# EAGLE design Adafruit 0.54 Alphanumeric v0.1 (EAGLE 6.3)
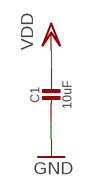
[diagram p0: schematic, sheet 1, part 1 of 2]
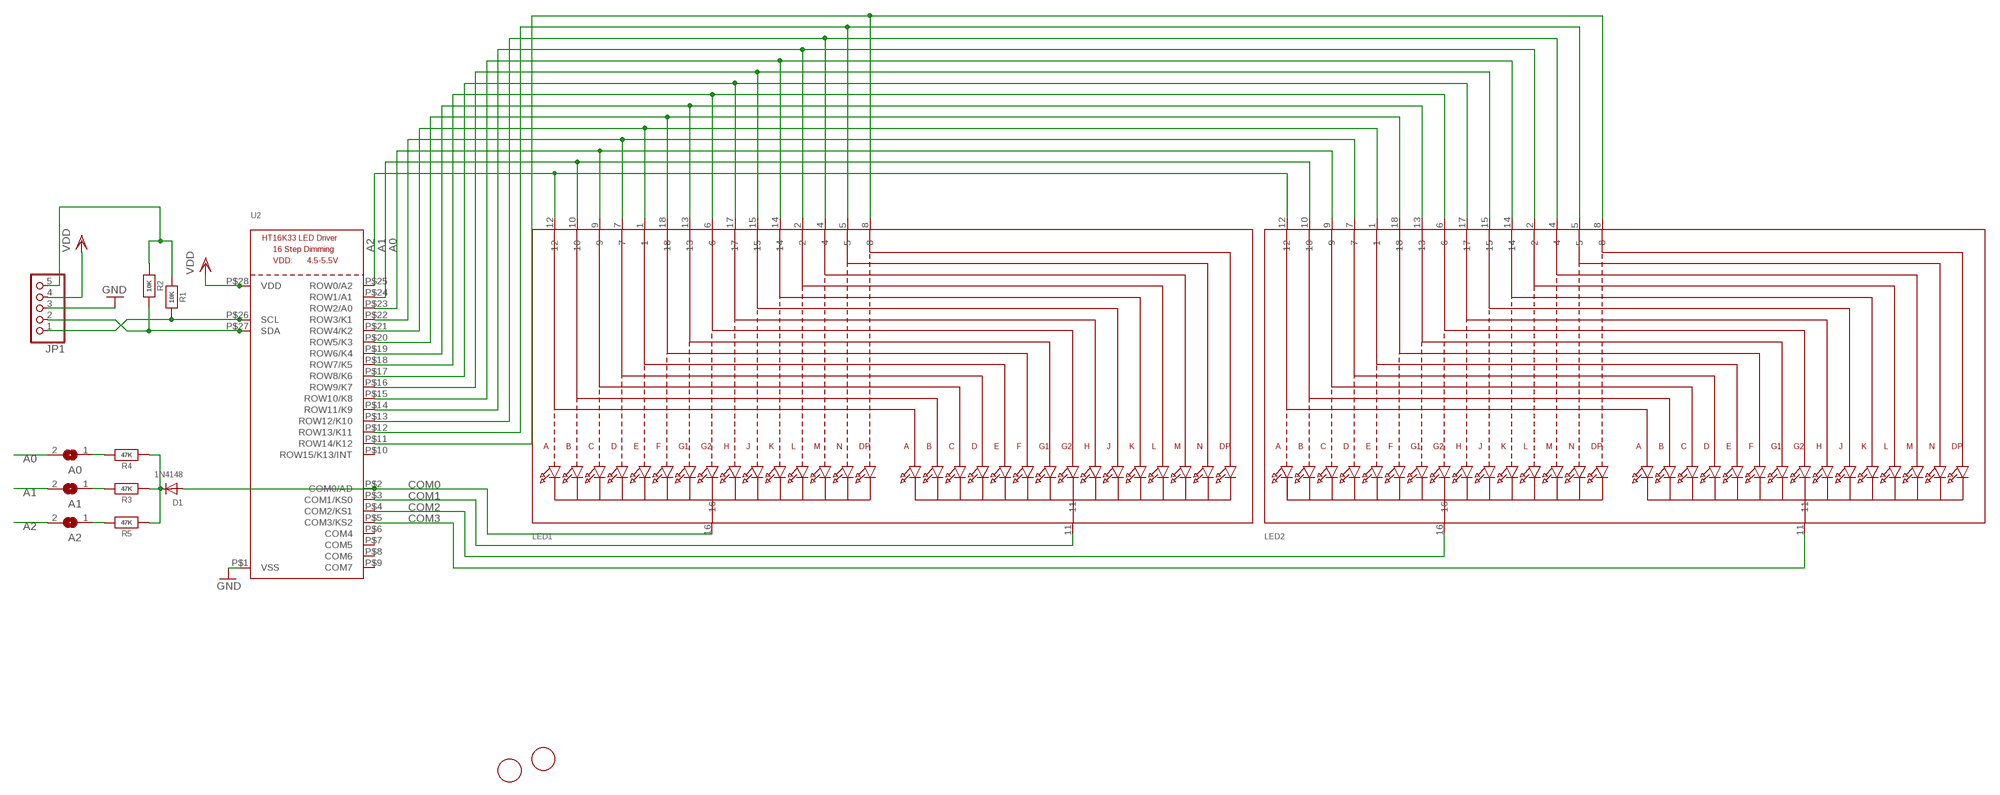
[diagram p1: schematic, sheet 1, part 2 of 2]

## Parts
A0  SOLDERJUMPERREFLOW_NOPASTE  [SOLDERJUMPER_REFLOW_NOPASTE]
A1  SOLDERJUMPERREFLOW_NOPASTE  [SOLDERJUMPER_REFLOW_NOPASTE]
A2  SOLDERJUMPERREFLOW_NOPASTE  [SOLDERJUMPER_REFLOW_NOPASTE]
C1  10uF  CAP_CERAMIC0805-NOOUTLINE  [0805-NO]
D1  1N4148  DIODESOD-323F  [SOD-323F]
JP1  HEADER-1X570MIL  [1X05_ROUND_70]
LED1  DISP_SEGMENT_STARBURST_DUAL_COMMONCATHODE  [SEGMENT_STARTBUST_DUAL_KWA-541CBB]
LED2  DISP_SEGMENT_STARBURST_DUAL_COMMONCATHODE  [SEGMENT_STARTBUST_DUAL_KWA-541CBB]
R1  10K  RESISTOR0805_NOOUTLINE  [0805-NO]
R2  10K  RESISTOR0805_NOOUTLINE  [0805-NO]
R3  47K  RESISTOR0805_NOOUTLINE  [0805-NO]
R4  47K  RESISTOR0805_NOOUTLINE  [0805-NO]
R5  47K  RESISTOR0805_NOOUTLINE  [0805-NO]
U2  HT16K33_SOP28  [SOP28_300MIL]
U$1  FIDUCIAL  [FIDUCIAL_1MM]
U$2  FIDUCIAL  [FIDUCIAL_1MM]

## Nets
A0: A0.2 LED1.9 LED2.9 U2.P$23(ROW2/A0)
A1: A1.2 LED1.10 LED2.10 U2.P$24(ROW1/A1)
A2: A2.2 LED1.12 LED2.12 U2.P$25(ROW0/A2)
COM0: D1.A LED1.16 U2.P$2(COM0/AD)
COM1: LED1.11 U2.P$3(COM1/KS0)
COM2: LED2.16 U2.P$4(COM2/KS1)
COM3: LED2.11 U2.P$5(COM3/KS2)
GND: C1.2 JP1.3 U2.P$1(VSS)
N$1: D1.C R3.1 R4.1 R5.1
N$2: JP1.5 R1.1 R2.1
N$4: LED1.17 LED2.17 U2.P$17(ROW8/K6)
N$5: LED1.15 LED2.15 U2.P$16(ROW9/K7)
N$6: LED1.14 LED2.14 U2.P$15(ROW10/K8)
N$7: A2.1 R5.2
N$8: LED1.2 LED2.2 U2.P$14(ROW11/K9)
N$9: LED1.4 LED2.4 U2.P$13(ROW12/K10)
N$10: LED1.7 LED2.7 U2.P$22(ROW3/K1)
N$11: LED1.1 LED2.1 U2.P$21(ROW4/K2)
N$12: LED1.18 LED2.18 U2.P$20(ROW5/K3)
N$13: LED1.13 LED2.13 U2.P$19(ROW6/K4)
N$14: LED1.5 LED2.5 U2.P$12(ROW13/K11)
N$15: LED1.8 LED2.8 U2.P$11(ROW14/K12)
N$16: LED1.6 LED2.6 U2.P$18(ROW7/K5)
N$19: A1.1 R3.2
N$20: A0.1 R4.2
SCL: JP1.1 R1.2 U2.P$26(SCL)
SDA: JP1.2 R2.2 U2.P$27(SDA)
VDD: C1.1 JP1.4 U2.P$28(VDD)
Unconnected: U2.P$6(COM4) U2.P$7(COM5) U2.P$8(COM6) U2.P$9(COM7) U2.P$10(ROW15/K13/INT)

## Library data of the parts
A0 A1 A2 = microbuilder:SOLDERJUMPER: SMD Solder JUMPER Solder the two pads together to create a connection, or remove the solder to break it. REFLOW - Use this footprint for solder paste and reflow ovens. WAVE - Use this footprint for hand-soldering (larger pads). CLOSED - Has a trace between the two pads to ensure it is closed by default. The trace needs to be cut to disable the jumper, and can be closed again by creating a solder bridge between the two pads.
C1 = microbuilder:CAP_CERAMIC: Ceramic Capacitors For new designs, use the packages preceded by an '_' character since they are more reliable: The following footprints should be used on most boards: _0402 - Standard footprint for regular board layouts _0603 - Standard footprint for regular board layouts _0805 - Standard footprint for regular board layouts _1206 - Standard footprint for regular board layouts For extremely tight-pitch boards where space is at a premium, the following 'micro-pitch' footprints can be used (smaller pads, no silkscreen outline, etc.): _0402MP - Micro-pitch footprint for very dense/compact boards _0603MP - Micro-pitch footprint for very dense/compact boards _0805MP - Micro-pitch footprint for very dense/compact boards _1206MP - Micro-pitch footprint for very dense/compact boards
D1 = adafruit:DIODE: Diode SMADIODE - SMA Surface Mount Package 20V 1A Schottky Diode Digikey: 641-1014-6-ND DO-1N4148 - Through Hole Small Current Diode SOD-123 20V 1 A (.5mV Vf) Schottky Diode - Digikey: MBRX120TPMSCT-ND SOD-323 10V 570mA (.38mV Vf, 3ns) Schottky Diode - Digikey: ZLLS410CT-ND SOD-523 30V 30mA Schottky Diode (RB751S-40TE61) - Digikey: RB751S-40TE61CT-ND SOT23-R/W - SOT23 Package (R = Solder Paste/Reflow Ovens, W = Hand-Soldering) BAT54Film 40V 300mA - Digikey: 497-7162-1-ND
JP1 = microbuilder:HEADER-1X5: PIN HEADER
LED1 LED2 = microbuilder:DISP_SEGMENT_STARBURST_DUAL_COMMONCATHODE: 2 x Starburst Segment Displays - Common Cathode Luckylight KWA-541CBB
R1-R5 = microbuilder:RESISTOR: Resistors For new designs, use the packages preceded by an '_' character since they are more reliable: The following footprints should be used on most boards: _0402 - Standard footprint for regular board layouts _0603 - Standard footprint for regular board layouts _0805 - Standard footprint for regular board layouts _1206 - Standard footprint for regular board layouts For extremely tight-pitch boards where space is at a premium, the following 'micro-pitch' footprints can be used (smaller pads, no silkscreen outline, etc.): _0402MP - Micro-pitch footprint for very dense/compact boards _0603MP - Micro-pitch footprint for very dense/compact boards _0805MP - Micro-pitch footprint for very dense/compact boards _1206MP - Micro-pitch footprint for very dense/compact boards
U2 = microbuilder:HT16K33_SOP28
U$1 U$2 = adafruit:FIDUCIAL: For use by pick and place machines to calibrate the vision/machine, 1mm By microbuilder.eu

## Board
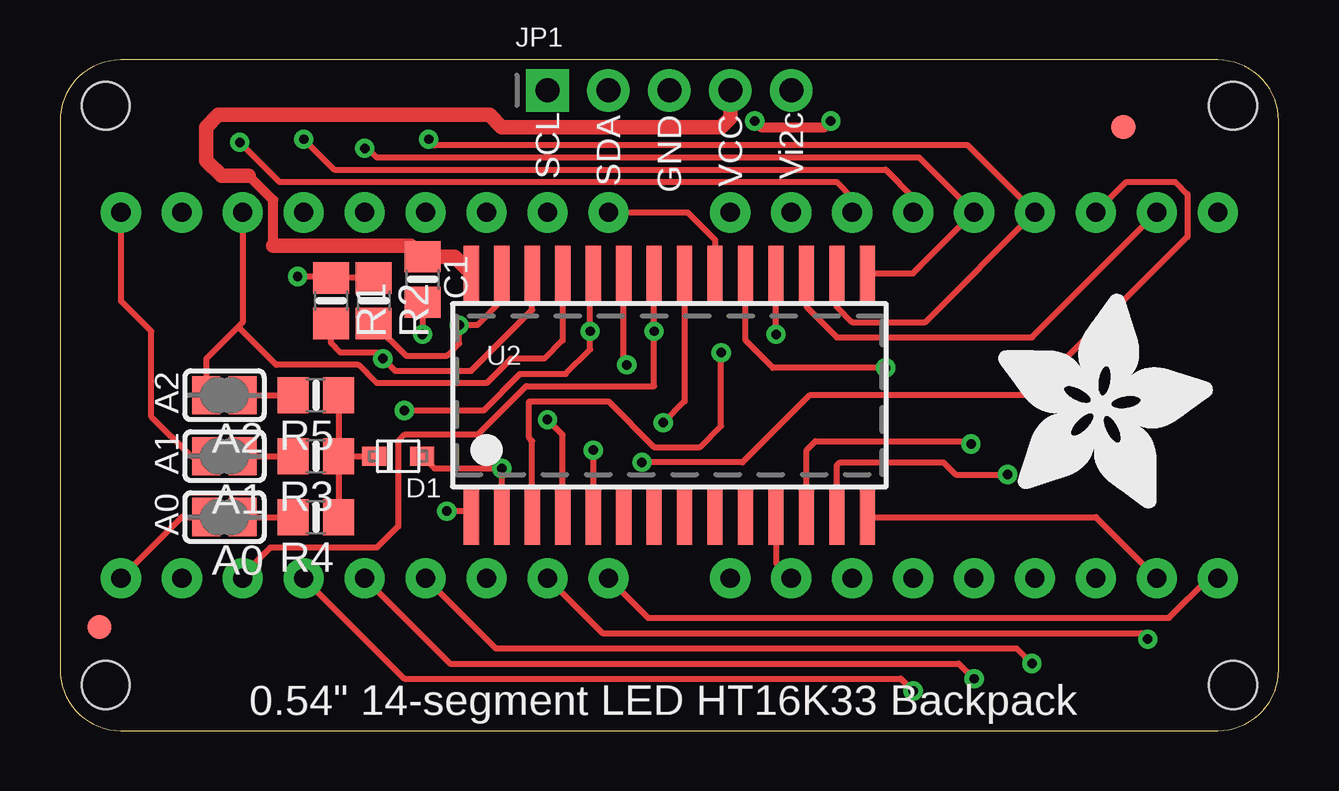
[diagram p2: board, top side]
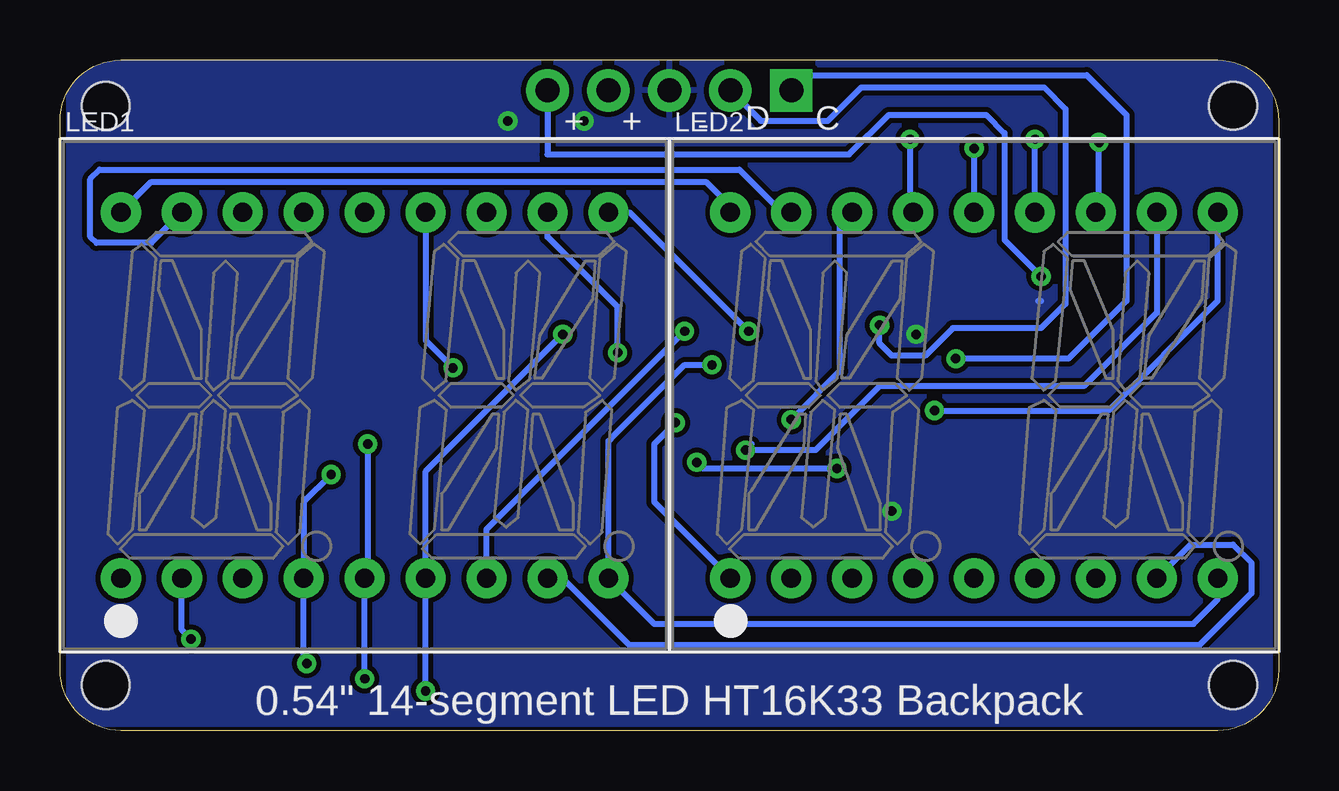
[diagram p3: board, bottom side, seen from below]

Size 50.8 x 27.94 mm. Coordinates in mm from the lower left corner, seen from the top.
Outline: 0,25.4 0,2.54 arc90 2.54,0 48.26,0 arc90 50.8,2.54 50.8,25.4 arc90 48.26,27.94 2.54,27.94 arc90 0,25.4
Copper layers (1*16): Top 0.035mm / dielectric 1.5mm / Bottom 0.035mm
Design rules "default *": minimum track width 8mil, minimum drill 15mil, track to track 8mil, track to pad 8mil, pad to pad 8mil, via to via 8mil, smd to smd 8mil, copper to edge 1mil, drill to drill 8mil, minimum pad ring 10mil, minimum via ring 8mil, stop-mask expansion 4mil, vias tented up to drill 20mil, thermal gap 10mil
Holes 2 mm at 1.9,1.91 48.89,1.91 1.9,26.04 48.89,26.04

### Footprints (pad centres in the part's own frame; a part is rotated, then mirrored left to right if it is on the bottom)
SOLDERJUMPER_REFLOW_NOPASTE = smd 1.168 x 1.6: 1 -0.762,0; 2 0.762,0
0805-NO = smd 1.3 x 1.5: 1 -0.95,0; 2 0.95,0
SOD-323F = smd 1 x 0.8: A -1,0; C 1,0
1X05_ROUND_70 = drill 1 pad 1.778 square: 1 -5.08,0 | drill 1 pad 1.778: 2 -2.54,0; 3 0,0; 4 2.54,0; 5 5.08,0
SEGMENT_STARTBUST_DUAL_KWA-541CBB = drill 0.8 pad 1.676: 1 -10.16,-7.62; 2 -7.62,-7.62; 3 -5.08,-7.62; 4 -2.54,-7.62; 5 0,-7.62; 6 2.54,-7.62; 7 5.08,-7.62; 8 7.62,-7.62; 9 10.16,-7.62; 10 10.16,7.62; 11 7.62,7.62; 12 5.08,7.62; 13 2.54,7.62; 14 0,7.62; 15 -2.54,7.62; 16 -5.08,7.62; 17 -7.62,7.62; 18 -10.16,7.62
SOP28_300MIL = smd 0.635 x 2.286: P$1 -8.255,-5.08; P$2 -6.985,-5.08; P$3 -5.715,-5.08; P$4 -4.445,-5.08; P$5 -3.175,-5.08; P$6 -1.905,-5.08; P$7 -0.635,-5.08; P$8 0.635,-5.08; P$9 1.905,-5.08; P$10 3.175,-5.08; P$11 4.445,-5.08; P$12 5.715,-5.08; P$13 6.985,-5.08; P$14 8.255,-5.08; P$15 8.255,5.08; P$16 6.985,5.08; P$17 5.715,5.08; P$18 4.445,5.08; P$19 3.175,5.08; P$20 1.905,5.08; P$21 0.635,5.08; P$22 -0.635,5.08; P$23 -1.905,5.08; P$24 -3.175,5.08; P$25 -4.445,5.08; P$26 -5.715,5.08; P$27 -6.985,5.08; P$28 -8.255,5.08
FIDUCIAL_1MM = smd 1 x 1: 1 0,0

### Placement (x,y rotation side)
A0  6.86,8.89 180 top
A1  6.86,11.43 180 top
A2  6.86,13.97 180 top
C1  15.11,18.8 270 top
D1  14.1,11.43 180 top
JP1  25.4,26.67 0 top
LED1  38.1,13.97 0 bottom
LED2  12.7,13.97 0 bottom
R1  11.3,17.91 270 top
R2  13.08,17.91 270 top
R3  10.67,11.43 180 top
R4  10.67,8.89 180 top
R5  10.67,13.97 180 top
U2  25.4,13.97 0 top
U$1  44.32,25.15 0 top
U$2  1.65,4.32 0 top
U$3  [ADAFRUIT_9MM]  39.12,9.27 0 top

### Tracks (layer width: path | path; a pad name or v marks a point on that pad's centre or on a via)
A0  (via drill 0.39)
  Top 0.254: v23.62,15.24 23.62,15.37 23.49,15.49 U2.P$23 | LED2.9 5.08,8.89 A0.2
  Bottom 0.254: v23.62,15.24 24.76,15.24 27.69,12.32 27.94,12.07 LED1.9 26.04,4.45 3.56,4.45 2.54,5.46 LED2.9
A1  (via drill 0.39)
  Top 0.254: LED2.10 2.54,17.91 3.81,16.64 3.81,13.08 5.46,11.43 A1.2 | U2.P$24 22.1,18.92 v22.1,16.64 22.1,15.88 21.08,14.86 19.18,14.86 17.65,13.34 v14.35,13.34
  Bottom 0.254: LED1.10 27.05,21.59 v22.1,16.64 | 2.41,21.46 LED2.10 2.54,17.91 7.11,13.34 v14.35,13.34
A2  (via drill 0.39)
  Top 0.254: v7.49,24.51 9.14,22.86 32.38,22.86 33.02,22.23 LED1.12 | U2.P$25 20.95,16.26 20.19,15.49 18.8,15.49 17.78,14.48 13.21,14.48 12.45,15.24 9.02,15.24 7.43,16.83 | 6.35,13.97 A2.2 6.1,15.49 7.43,16.83 | LED2.12 7.62,17.02 7.43,16.83
  Bottom 0.254: LED2.12 7.49,21.72 v7.49,24.51
COM0  (via drill 0.39)
  Top 0.254: LED1.16 44.45,22.86 46.48,22.86 46.99,22.35 46.99,20.57 40.39,13.97 31.24,13.97 28.45,11.18 v24.26,11.18 | U2.P$2 v18.41,10.92 15.6,10.92 D1.A
  Bottom 0.254: v24.26,11.18 24,10.92 v18.41,10.92
COM1  (via drill 0.39)
  Top 0.254: U2.P$3 19.68,12.07 19.56,12.19 19.56,13.72 22.86,13.72 24.76,11.81 26.67,11.81 27.56,12.7 v27.56,15.75
  Bottom 0.254: v27.56,15.75 27.56,17.65 30.48,20.57 LED1.11
COM2  (via drill 0.39)
  Top 0.254: U2.P$4 20.95,12.32 v20.32,12.95
  Bottom 0.254: v20.32,12.95 18.29,14.99 18.29,21.21 17.91,21.59 LED2.16
COM3  (via drill 0.39)
  Top 0.254: v22.22,11.68 U2.P$5
  Bottom 0.254: LED2.11 5.08,17.4 8.13,14.35 16.64,14.35 19.3,11.68 v22.22,11.68 21.97,11.94
GND  (via drill 0.39)
  Top 0.254: U2.P$1 17.14,9.14 v16.13,9.14 | C1.2 v15.11,16.51
  Top 0.406: v28.96,25.4 29.21,25.15 31.88,25.15 v32.13,25.4
  Bottom 0.254: 9.91,17.91 10.03,17.91 | v16.13,9.14 16.13,9.27
  pour Bottom: 0.38,28.96 0.38,0.25 50.42,0.25 50.42,28.96
N$1
  Top 0.254: R3.1 D1.C | R5.1 R3.1 | R3.1 R4.1
N$2  (via drill 0.39)
  Top 0.254: R2.1 R1.1 11.24,18.92 v9.91,18.92
  Bottom 0.254: JP1.5 30.48,24 17.91,24 16.26,25.65 12.19,25.65 11.43,24.89 11.43,20.45 v9.91,18.92
N$4
  Top 0.254: U2.P$17 31.11,17.65 32.38,16.38 40.51,16.38 LED1.17
  Bottom 0.254: LED1.17 46.99,20.32 49.28,20.32 49.53,20.57 49.53,22.99 49.15,23.37 22.48,23.37 20.7,21.59 LED2.17
N$5  (via drill 0.39)
  Top 0.254: v15.37,24.64 15.62,24.38 37.85,24.38 LED1.15 36.07,17.02 33.02,17.02 32.38,17.65 U2.P$16
  Bottom 0.254: v15.37,24.64 15.37,21.72 LED2.15
N$6  (via drill 0.39)
  Top 0.254: v12.7,24.26 12.83,24.26 13.21,23.88 35.81,23.88 LED1.14 35.56,19.05 U2.P$15
  Bottom 0.254: v12.7,24.26 LED2.14
N$7
  Top 0.254: A2.1 R5.2
N$8  (via drill 0.39)
  Top 0.254: U2.P$14 43.18,8.89 LED1.2 | LED2.2 22.61,4.06 45.08,4.06 v45.34,3.81
  Bottom 0.254: v45.34,3.81 45.72,4.19 LED1.2
N$9  (via drill 0.39)
  Top 0.254: LED2.4 18.16,3.43 39.88,3.43 v40.51,2.79 | U2.P$13 32.38,11.05 32.51,11.18 36.83,11.18 37.34,10.67 v39.5,10.67
  Bottom 0.254: v40.51,2.79 40.64,2.92 LED1.4 40.64,9.53 v39.5,10.67
N$10  (via drill 0.39)
  Top 0.254: U2.P$22 v24.76,16.64 24.76,14.35 19.43,14.35 17.4,12.32 14.35,12.32 14.1,12.07 14.1,8.51 13.21,7.62 8.76,7.62 7.62,6.48 LED2.7
  Bottom 0.254: LED1.7 33.02,8.38 v24.76,16.64
N$11  (via drill 0.39)
  Top 0.254: LED2.1 24.51,4.7 46.23,4.7 47.88,6.35 LED1.1 | U2.P$21 26.04,13.72 v25.15,12.83
  Bottom 0.254: v25.15,12.83 26.04,11.94 26.04,9.53 LED2.1
N$12
  Top 0.254: LED2.18 26.16,21.59 27.3,20.45 U2.P$20
  Bottom 0.254: LED1.18 46.99,22.86 23.88,22.86 22.86,21.84 LED2.18
N$13  (via drill 0.39)
  Top 0.254: v10.16,24.64 11.43,23.37 34.42,23.37 35.56,22.23 LED1.13 | v34.42,15.11 29.72,15.11 28.57,16.26 U2.P$19
  Bottom 0.254: LED2.13 v10.16,24.64 | LED1.13 35.56,16.26 v34.42,15.11
N$14  (via drill 0.39)
  Top 0.254: LED2.5 16.26,2.79 37.46,2.79 v38.1,2.16 | U2.P$12 31.11,11.68 31.5,12.07 37.85,12.07 v37.97,11.94
  Bottom 0.254: v38.1,2.16 LED1.5 37.97,6.48 v37.97,11.94
N$15
  Top 0.254: U2.P$11 29.84,6.99 LED1.8
  Bottom 0.254: LED2.8 3.68,7.75 1.9,7.75 1.14,6.99 1.14,5.71 3.3,3.56 27.05,3.56 29.84,6.35 LED1.8
N$16  (via drill 0.39)
  Top 0.254: v29.84,16.51 U2.P$18 | LED2.6 14.35,2.16 35.05,2.16 v35.56,1.65
  Bottom 0.254: v29.84,16.51 35.56,10.8 LED1.6 v35.56,1.65
N$19
  Top 0.254: A1.1 R3.2
N$20
  Top 0.254: A0.1 R4.2
SCL  (via drill 0.39)
  Top 0.254: U2.P$26 19.68,17.53 17.14,14.99 13.97,14.99 v13.46,15.49 13.21,15.75 11.68,15.75 11.3,16.13 R1.2
  Bottom 0.254: JP1.1 19.68,27.3 8,27.3 6.35,25.65 6.35,17.91 8.76,15.49 v13.46,15.49
SDA  (via drill 0.39)
  Top 0.254: U2.P$27 18.41,17.91 17.4,16.89 v16.64,16.89 | 16.62,16.91 v16.64,16.89 | R2.2 14.42,15.62 16.13,15.62 16.64,16.13 v16.64,16.89
  Bottom 0.254: JP1.2 21.59,25.4 18.8,25.4 17.4,26.8 9.78,26.8 8.89,25.91 8.89,17.78 9.91,16.76 13.59,16.76 14.73,15.62 16.13,15.62 16.64,16.13 v16.64,16.89
VDD
  Top 0.406: 8.89,20.19 8.89,22.1 7.87,23.11
  Top 0.61: 7.87,23.11 6.73,23.11 6.1,23.75 6.1,25.15 6.6,25.65 17.91,25.65 18.41,25.15 27.56,25.15 27.94,25.53 JP1.4 | 8.89,20.19 14.6,20.19 15.11,19.69 C1.1 16.45,19.75 U2.P$28

### Text on the board
tPlace: SCL | SDA | GND | VCC | Vi2c | A2 | A1 | A0 | 0.54" 14-segment LED HT16K33 Backpack
bPlace: C | D | - | + | + | 0.54" 14-segment LED HT16K33 Backpack